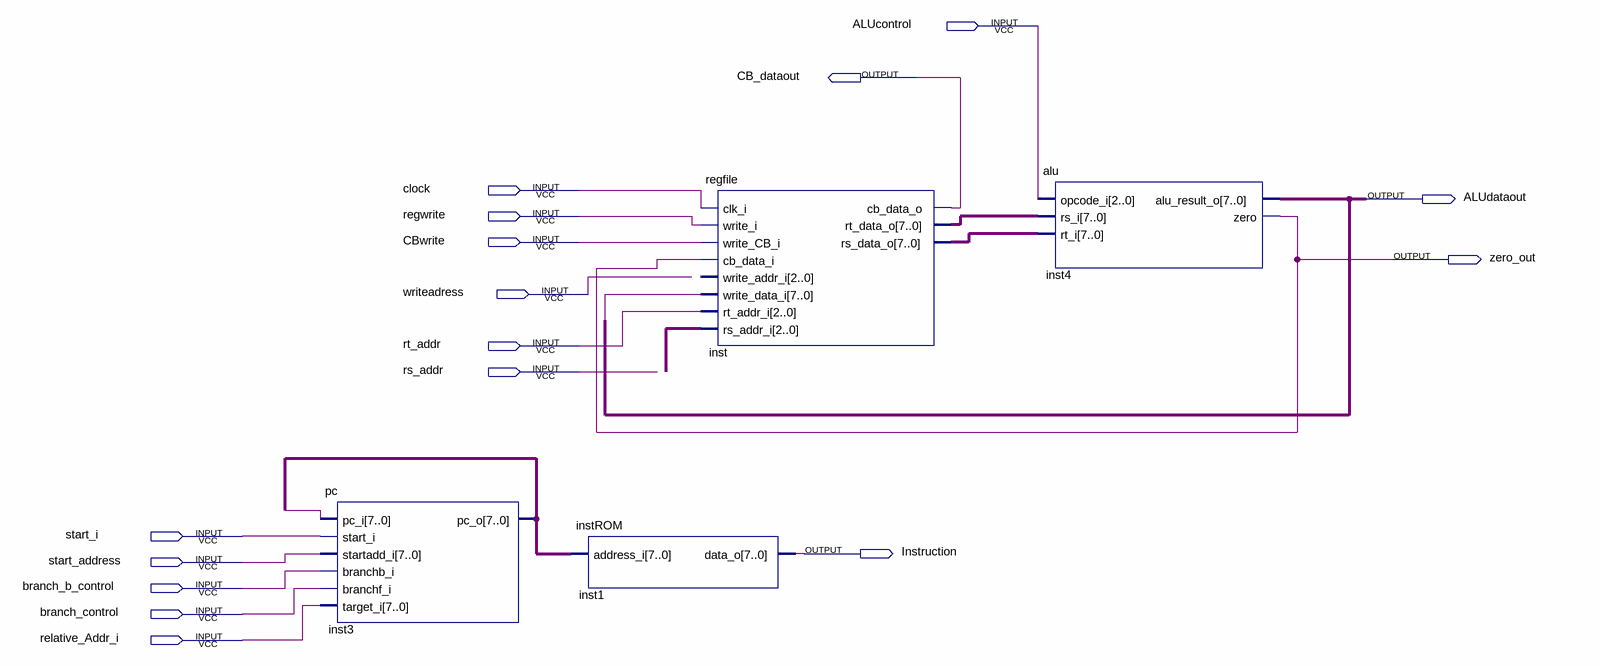
[diagram p0: schematic sheet]
// Quartus schematic cse141llab2.bdf as structural Verilog: 4 symbols, 16 pins
module cse141llab2 (
  input  ALUcontrol,
  input  clock,
  input  regwrite,
  input  CBwrite,
  input  writeadress,
  input  rt_addr,
  input  rs_addr,
  input  start_i,
  input  start_address,
  input  branch_b_control,
  input  branch_control,
  input  relative_Addr_i,
  output CB_dataout,
  output ALUdataout,
  output zero_out,
  output Instruction
);

  wire undriven, undriven_3;
  wire [2:0] undriven_2;
  wire [7:0] inst3_pc_o, inst4_alu_result_o, inst_rs_data_o, inst_rt_data_o;

  pc inst3 (
    .pc_i({8{undriven_3}}), .start_i(start_i), .startadd_i({8{start_address}}), .branchb_i(branch_b_control),
    .branchf_i(branch_control), .target_i({8{relative_Addr_i}}), .pc_o(inst3_pc_o));
  instROM inst1 (.address_i(inst3_pc_o), .data_o(Instruction));
  regfile inst (
    .clk_i(clock), .write_i(regwrite), .write_CB_i(CBwrite), .cb_data_i(zero_out),
    .write_data_i({8{undriven}}), .rt_addr_i({3{rt_addr}}), .rs_addr_i(undriven_2), .cb_data_o(CB_dataout),
    .rt_data_o(inst_rt_data_o), .rs_data_o(inst_rs_data_o));  // open: write_addr_i
  alu inst4 (
    .opcode_i({3{ALUcontrol}}), .rs_i(inst_rt_data_o), .rt_i(inst_rs_data_o),
    .alu_result_o(inst4_alu_result_o), .zero(zero_out));
endmodule
